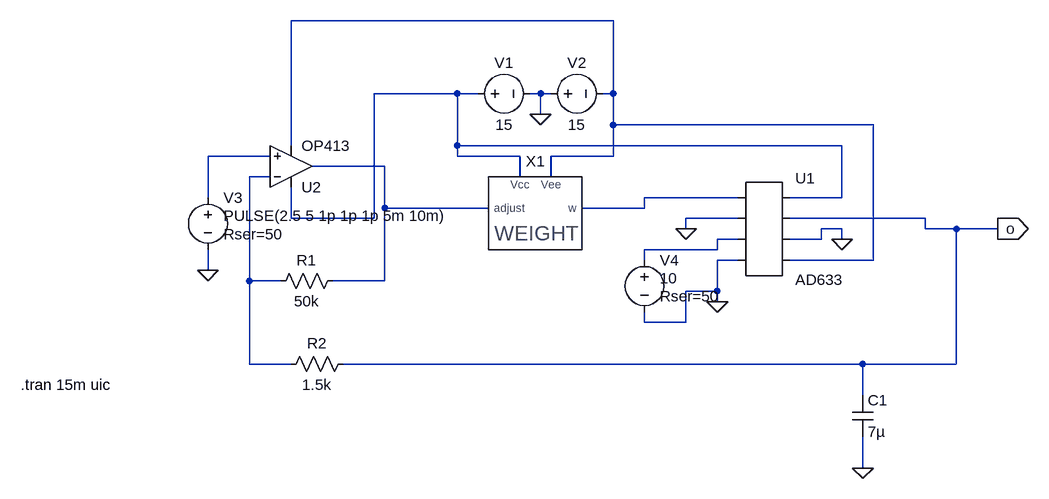
[diagram p0: schematic Draft12.asc]
Draft12.asc, the LTspice schematic file:
Version 4
SHEET 1 952 680
WIRE 288 -112 -208 -112
WIRE 48 0 -80 0
WIRE 80 0 48 0
WIRE 176 0 160 0
WIRE 192 0 176 0
WIRE 288 0 288 -112
WIRE 288 0 272 0
WIRE 176 32 176 0
WIRE 288 48 288 0
WIRE 688 48 288 48
WIRE -208 80 -208 -112
WIRE 48 80 48 0
WIRE 640 80 48 80
WIRE -240 96 -336 96
WIRE 48 96 48 80
WIRE 144 96 48 96
WIRE 288 96 288 48
WIRE 288 96 192 96
WIRE -64 112 -176 112
WIRE -240 128 -272 128
WIRE 144 128 144 96
WIRE 192 128 192 96
WIRE -336 160 -336 96
WIRE 480 160 336 160
WIRE 640 160 640 80
WIRE 640 160 560 160
WIRE -64 176 -64 112
WIRE 96 176 -64 176
WIRE 336 176 336 160
WIRE 336 176 240 176
WIRE -208 192 -208 144
WIRE -80 192 -80 0
WIRE -80 192 -208 192
WIRE 480 192 400 192
WIRE 768 192 560 192
WIRE 400 208 400 192
WIRE 640 208 608 208
WIRE 768 208 768 192
WIRE 816 208 768 208
WIRE 880 208 816 208
WIRE 480 224 448 224
WIRE 608 224 608 208
WIRE 608 224 560 224
WIRE 640 224 640 208
WIRE 448 240 448 224
WIRE 448 240 336 240
WIRE 336 256 336 240
WIRE 480 256 448 256
WIRE 688 256 688 48
WIRE 688 256 560 256
WIRE -336 272 -336 240
WIRE -272 288 -272 128
WIRE -224 288 -272 288
WIRE -64 288 -64 176
WIRE -64 288 -144 288
WIRE 448 304 448 256
WIRE 448 304 400 304
WIRE 448 320 448 304
WIRE 336 352 336 336
WIRE 400 352 400 304
WIRE 400 352 336 352
WIRE -272 416 -272 288
WIRE -208 416 -272 416
WIRE 672 416 -128 416
WIRE 816 416 816 208
WIRE 816 416 672 416
WIRE 672 464 672 416
WIRE 672 576 672 528
FLAG 176 32 0
FLAG -336 272 0
FLAG 400 208 0
FLAG 448 320 0
FLAG 640 224 0
FLAG 880 208 o
IOPIN 880 208 Out
FLAG 672 576 0
SYMBOL Weight 160 176 R0
SYMATTR InstName X1
SYMBOL voltage 64 0 R270
WINDOW 0 32 56 VTop 2
WINDOW 3 -32 56 VBottom 2
WINDOW 123 0 0 Left 0
WINDOW 39 0 0 Left 0
SYMATTR InstName V1
SYMATTR Value 15
SYMBOL voltage 176 0 R270
WINDOW 0 32 56 VTop 2
WINDOW 3 -32 56 VBottom 2
WINDOW 123 0 0 Left 0
WINDOW 39 0 0 Left 0
SYMATTR InstName V2
SYMATTR Value 15
SYMBOL voltage -336 144 R0
WINDOW 3 24 44 Left 2
WINDOW 123 0 0 Left 0
WINDOW 39 24 72 Left 2
SYMATTR Value PULSE(2.5 5 1p 1p 1p 5m 10m)
SYMATTR SpiceLine Rser=50
SYMATTR InstName V3
SYMBOL voltage 336 240 R0
WINDOW 3 24 44 Left 2
WINDOW 123 0 0 Left 0
WINDOW 39 24 72 Left 2
SYMATTR Value 10
SYMATTR SpiceLine Rser=50
SYMATTR InstName V4
SYMBOL AutoGenerated\\AD633 512 208 R0
SYMATTR InstName U1
SYMBOL OpAmps\\OP413 -208 176 M180
SYMATTR InstName U2
SYMBOL res -112 400 R90
WINDOW 0 0 56 VBottom 2
WINDOW 3 32 56 VTop 2
SYMATTR InstName R2
SYMATTR Value 1.5k
SYMBOL res -128 272 R90
WINDOW 0 0 56 VBottom 2
WINDOW 3 32 56 VTop 2
SYMATTR InstName R1
SYMATTR Value 50k
SYMBOL cap 656 464 R0
SYMATTR InstName C1
SYMATTR Value 7µ
TEXT -624 448 Left 2 !.tran 15m uic

The netlist it stands for:
* Draft12.asc
XX1 N004 N002 N001 N006 Weight  ; pins adjust Vcc Vee w
V1 N002 0 15
V2 0 N001 15
V3 N003 0 PULSE(2.5 5 1p 1p 1p 5m 10m) Rser=50
V4 N007 0 10 Rser=50
* U1: AD633 (symbol AutoGenerated\AD633 not available, pins judged from their places): pin1=N006 pin2=0 pin3=N007 pin4=0 pin5=N002 pin6=o pin7=0 pin8=N001
XU2 N003 N005 N002 N001 N004 OP413  ; pins In+ In- V+ V- OUT
R2 o N005 1.5k
R1 N004 N005 50k
C1 o 0 7µ
.tran 15m uic
.backanno
.end